# Altium schematic sheet HS1-HS2.SchDoc
size Legal
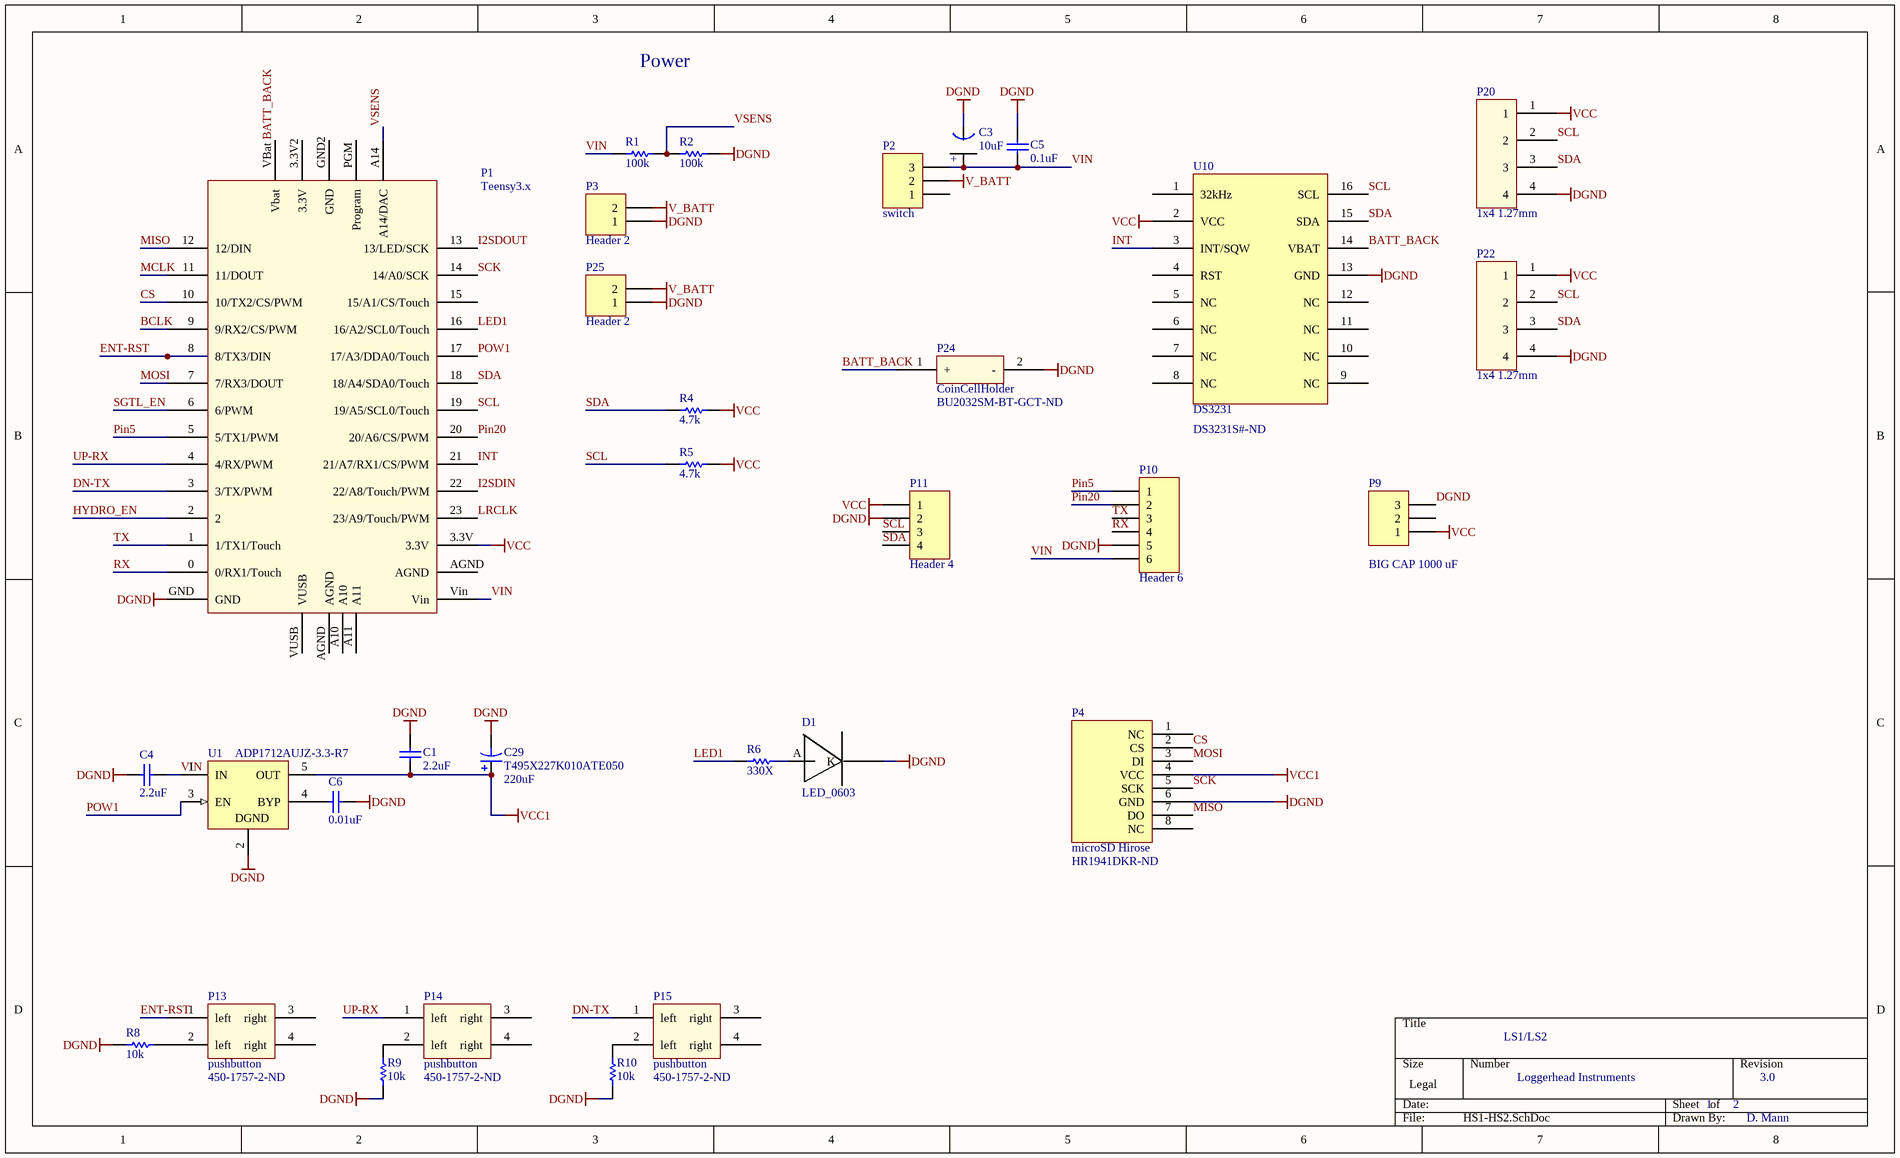
[diagram p0: HS1-HS2.SchDoc]

## Parts
C1  2.2uF  [0402]
C3  10uF  [Tant0805]
C4  2.2uF  [0402]
C5  0.1uF  [0402]
C6  0.01uF  [0402]
C29  T495X227K010ATE050  value 220uF  [X]
D1  LED_0603  [Diode0603]
P1  Teensy3.x  [Teensy3.x]
P2  switch  [HDR1X3]
P3  Header 2  [HDR1X2]
P4  microSD Hirose  Supplier Part Number 1: HR1941DKR-ND  [DM3D microSD]
P9  BIG CAP 1000 uF  [HDR1X3]
P10  Header 6  [HDR1X6]
P11  Header 4  [HDR1X4]
P13  pushbutton  Supplier Part Number 1: 450-1757-2-ND  [SOP4]
P14  pushbutton  Supplier Part Number 1: 450-1757-2-ND  [SOP4]
P15  pushbutton  Supplier Part Number 1: 450-1757-2-ND  [SOP4]
P20  1x4 1.27mm  [Header1x4 1.27mm]
P22  1x4 1.27mm  [Header1x4 1.27mm]
P24  CoinCellHolder  Supplier Part Number 1: BU2032SM-BT-GCT-ND  [CoinCellHolder]
P25  Header 2  [HDR1X2]
R1  100k  [3-0603]
R2  100k  [3-0603]
R4  4.7k  [3-0603]
R5  4.7k  [3-0603]
R6  330X  [3-0603]
R8  10k  [3-0603]
R9  10k  [3-0603]
R10  10k  [3-0603]
U1  ADP1712AUJZ-3.3-R7  [MF05A_N]
U10  DS3231  Supplier Part Number 1: DS3231S#-ND  [DS3231]

## Nets
DGND: C1.1 C3.1(GND) C4.2 C5.2 C6.2 C29.2 D1.K P1.GND P3.1 P4.6(GND) P9.3 P10.5 P11.2 P20.4 P22.4 P24.2(-) P25.1 R2.1 R8.2 R9.2 R10.2 U1.2(GND) U10.13(GND)
V_BATT: P2.2 P3.2 P25.2
VCC: P1.3.3V P9.1 P11.1 P20.1 P22.1 R4.2 R5.2 U10.2(VCC)
VCC1: C1.2 C29.1 P4.4(VCC) U1.5(OUT)
BATT_BACK: P1.VBat(Vbat) P24.1(+) U10.14(VBAT)
BCLK: P1.9(9/RX2/CS/PWM)
CS: P1.10(10/TX2/CS/PWM) P4.2(CS)
DN-TX: P1.3(3/TX/PWM) P15.1(left)
ENT-RST: P1.8(8/TX3/DIN) P13.1(left)
HYDRO_EN: P1.2
I2SDIN: P1.22(22/A8/Touch/PWM)
I2SDOUT: P1.13(13/LED/SCK)
INT: P1.21(21/A7/RX1/CS/PWM) U10.3(INT/SQW)
LED1: P1.16(16/A2/SCL0/Touch) R6.1
LRCLK: P1.23(23/A9/Touch/PWM)
MCLK: P1.11(11/DOUT)
MISO: P1.12(12/DIN) P4.7(DO)
MOSI: P1.7(7/RX3/DOUT) P4.3(DI)
Pin5: P1.5(5/TX1/PWM) P10.1
Pin20: P1.20(20/A6/CS/PWM) P10.2
POW1: P1.17(17/A3/DDA0/Touch) U1.3(EN)
RX: P1.0(0/RX1/Touch) P10.4
SCK: P1.14(14/A0/SCK) P4.5(SCK)
SCL: P1.19(19/A5/SCL0/Touch) P11.3 P20.2 P22.2 R5.1 U10.16(SCL)
SDA: P1.18(18/A4/SDA0/Touch) P11.4 P20.3 P22.3 R4.1 U10.15(SDA)
SGTL_EN: P1.6(6/PWM)
TX: P1.1(1/TX1/Touch) P10.3
UP-RX: P1.4(4/RX/PWM) P14.1(left)
VIN: C3.2(+) C4.1 C5.1 P1.Vin P2.3 P10.6 R1.2 U1.1(IN)
VSENS: P1.A14(A14/DAC) R1.1 R2.2
NetC6_1: C6.1 U1.4(BYP)
NetD1_A: D1.A R6.2
NetP13_2: P13.2(left) R8.1
NetP14_2: P14.2(left) R9.1
NetP15_2: P15.2(left) R10.1

Not connected (* = marked no-connect by the designer): P1 3.3V2(3.3V) 15(15/A1/CS/Touch) A10 A11 AGND GND2(GND) PGM(Program) VUSB; P2 1; P4 1(NC) 8(NC); P9 2; P13 3(right) 4(right); P14 3(right) 4(right); P15 3(right) 4(right); U10 1(32kHz) 4(RST) 5(NC) 6(NC) 7(NC) 8(NC) 9(NC) 10(NC) 11(NC) 12(NC)

## Notes on the sheet
- Power
- LS1/LS2
- Loggerhead Instruments
- 1
- 2
- 3.0
- D. Mann
- (in symbol LP3985IM5-3.3) DGND

## Library data of the parts
C1 C4 C6 = C0402: Ceramic Chip Capacitor - Standard; Note: Footprint corresponds to dimensions for bulk cassette packaging. This case size has tightened tolerances.; Value: 0.1uF; Published: 17-Jul-2002; LatestRevisionDate: 19-Mar-2004; LatestRevisionNote: Silkscreen size reduced.; DatasheetDocument: Mar-2001; PackageDocument: Mar-2001; PackageReference: 0402; Publisher: Altium Limited; Code_JEITA: 0402; Code_IPC: 1005 [0402]; ComponentLink1Description: Manufacturer Link; ComponentLink1URL: http://www.kemet.com/; ComponentLink2Description: Datasheet; ComponentLink2URL: http://www.kemet.com/kemet/web/homepage/kechome.nsf/vapubfilesname/F3102TA.pdf/$file/F3102TA.pdf
C3 = Tant0805: Value: 10uF
C5 = C0402: Ceramic Chip Capacitor - Standard; Note: Footprint corresponds to dimensions for bulk cassette packaging. This case size has tightened tolerances.; Published: 17-Jul-2002; LatestRevisionDate: 19-Mar-2004; LatestRevisionNote: Silkscreen size reduced.; DatasheetDocument: Mar-2001; PackageDocument: Mar-2001; PackageReference: 0402; Publisher: Altium Limited; Code_JEITA: 0402; Code_IPC: 1005 [0402]; ComponentLink1Description: Manufacturer Link; ComponentLink1URL: http://www.kemet.com/; ComponentLink2Description: Datasheet; ComponentLink2URL: http://www.kemet.com/kemet/web/homepage/kechome.nsf/vapubfilesname/F3102TA.pdf/$file/F3102TA.pdf; Value: 0.1uF
C29 = T495X: Solid Tantalum Chip Capacitor, Standard T495 Series - Low ESR, Surge Robust; PCB_Layout: Round Glue Pad at 2.9 ±0.1mm in diameter at KEMET's option; Published: 17-Jul-2002; LatestRevisionDate: 19-Mar-2004; LatestRevisionNote: Silkscreen dimensions re-sized.; DatasheetDocument: Mar-2001; PackageDocument: Mar-2001; PackageReference: X; Publisher: Altium Limited; Code_JEITA: 7343-43; ComponentLink1Description: Manufacturer Link; ComponentLink1URL: http://www.kemet.com/; ComponentLink2Description: Datasheet; ComponentLink2URL: http://www.kemet.com/kemet/web/homepage/kechome.nsf/vapubfilesname/F3102TA.pdf/$file/F3102TA.pdf
P2 P9 = Header 3: Header, 3-Pin; LatestRevisionDate: 17-Jul-2002; LatestRevisionNote: Re-released for DXP Platform.; Publisher: Altium Limited
P3 P25 = Header 2: Header, 2-Pin; LatestRevisionDate: 17-Jul-2002; LatestRevisionNote: Re-released for DXP Platform.; Publisher: Altium Limited
P10 = Header 6: Header, 6-Pin; LatestRevisionDate: 17-Jul-2002; LatestRevisionNote: Re-released for DXP Platform.; Publisher: Altium Limited
P11 = Header 4: Header, 4-Pin; LatestRevisionDate: 17-Jul-2002; LatestRevisionNote: Re-released for DXP Platform.; Publisher: Altium Limited
P20 P22 = Header 1x4 1.27mm
R1 R2 R4-R6 R8-R10 = ERJ3RK: Precision Thick Film Chip Resistor, 10 Ohm to 1M Ohm Range, 1% and 0.5% Tolerance, 0603 Size, 0.063 W; Published: 17-Dec-2003; LatestRevisionDate: 19-Mar-2004; LatestRevisionNote: Silkscreen size reduced.; PackageDocument: Mar-2003; PackageReference: 3-0603; Publisher: Altium Limited; Code_IPC: 1608 [0603]; ComponentLink1Description: Manufacturer Link; ComponentLink1URL: http://www.panasonic.com/industrial/components/resistive_products.htm; ComponentLink2Description: Datasheet; ComponentLink2URL: http://www.panasonic.com/industrial/components/pdf/AOA0000CE2.pdf
U1 = LP3985IM5-3.3: Micropower, 150mA Low-Noise Ultra Low-Dropout CMOS Voltage Regulator; Manufacturer: National Semiconductor; CompType: LDO IC; PackageTopMarking: LDQB*XTT; PowerWise: N; Published: 4-Dec-2008; DatasheetVersion: Aug-2005; PackageVersion: revD, Aug-2008; PackageReference: MF05A; Publisher: Altium Limited; PackageDescription: Molded SOT-23, .115 x .063 x .040 in Body, 5 Lead, .0375 in Pitch; PartNumber: LP3985IM5-3.3; RoHS: O; PinCount: 5; DigiKeyPartNumber: LP3985IM5-3.3CT-ND; ComponentLink1Description: LP3985 Datasheet; ComponentLink1URL: http://www.national.com/ds/LP/LP3985.pdf; ComponentLink2Description: LP3985 Web Page; ComponentLink2URL: http://www.national.com/pf/LP/LP3985.html; ComponentLink3Description: MF05A Package Page; ComponentLink3URL: http://www.national.com/packaging/folders/mf05a.html
P4 = microSD Hirose: Supplier 1: Digi-Key
P13-P15 = pushbutton: Supplier 1: Digi-Key
P24 = CoinCellHolder: Supplier 1: Digi-Key
U10 = DS3231: Supplier 1: Digi-Key